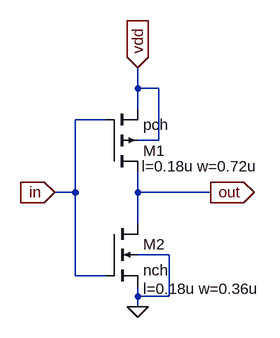
[diagram p0: schematic inv_sym.asc]
inv_sym.asc, the LTspice schematic file:
Version 4
SHEET 1 880 680
WIRE 208 48 208 16
WIRE 240 48 208 48
WIRE 208 80 208 48
WIRE 160 96 112 96
WIRE 240 128 240 48
WIRE 240 128 208 128
WIRE 112 208 112 96
WIRE 112 208 80 208
WIRE 208 208 208 176
WIRE 320 208 208 208
WIRE 208 256 208 208
WIRE 256 304 208 304
WIRE 112 336 112 208
WIRE 160 336 112 336
WIRE 208 368 208 352
WIRE 256 368 256 304
WIRE 256 368 208 368
WIRE 208 384 208 368
FLAG 208 384 0
FLAG 208 16 vdd
IOPIN 208 16 In
FLAG 80 208 in
IOPIN 80 208 In
FLAG 320 208 out
IOPIN 320 208 Out
SYMBOL pmos4 160 176 M180
WINDOW 123 54 8 Left 2
SYMATTR InstName M1
SYMATTR Value pch
SYMATTR Value2 l=0.18u w=0.72u
SYMBOL nmos4 160 256 R0
WINDOW 123 56 100 Left 2
SYMATTR InstName M2
SYMATTR Value nch
SYMATTR Value2 l=0.18u w=0.36u

The netlist it stands for:
* inv_sym.asc
M1 out in vdd vdd pch l=0.18u w=0.72u
M2 out in 0 0 nch l=0.18u w=0.36u
.model NMOS NMOS
.model PMOS PMOS
.lib standard.mos
.backanno
.end